# EAGLE schematic C7 (EAGLE 7.5.0)
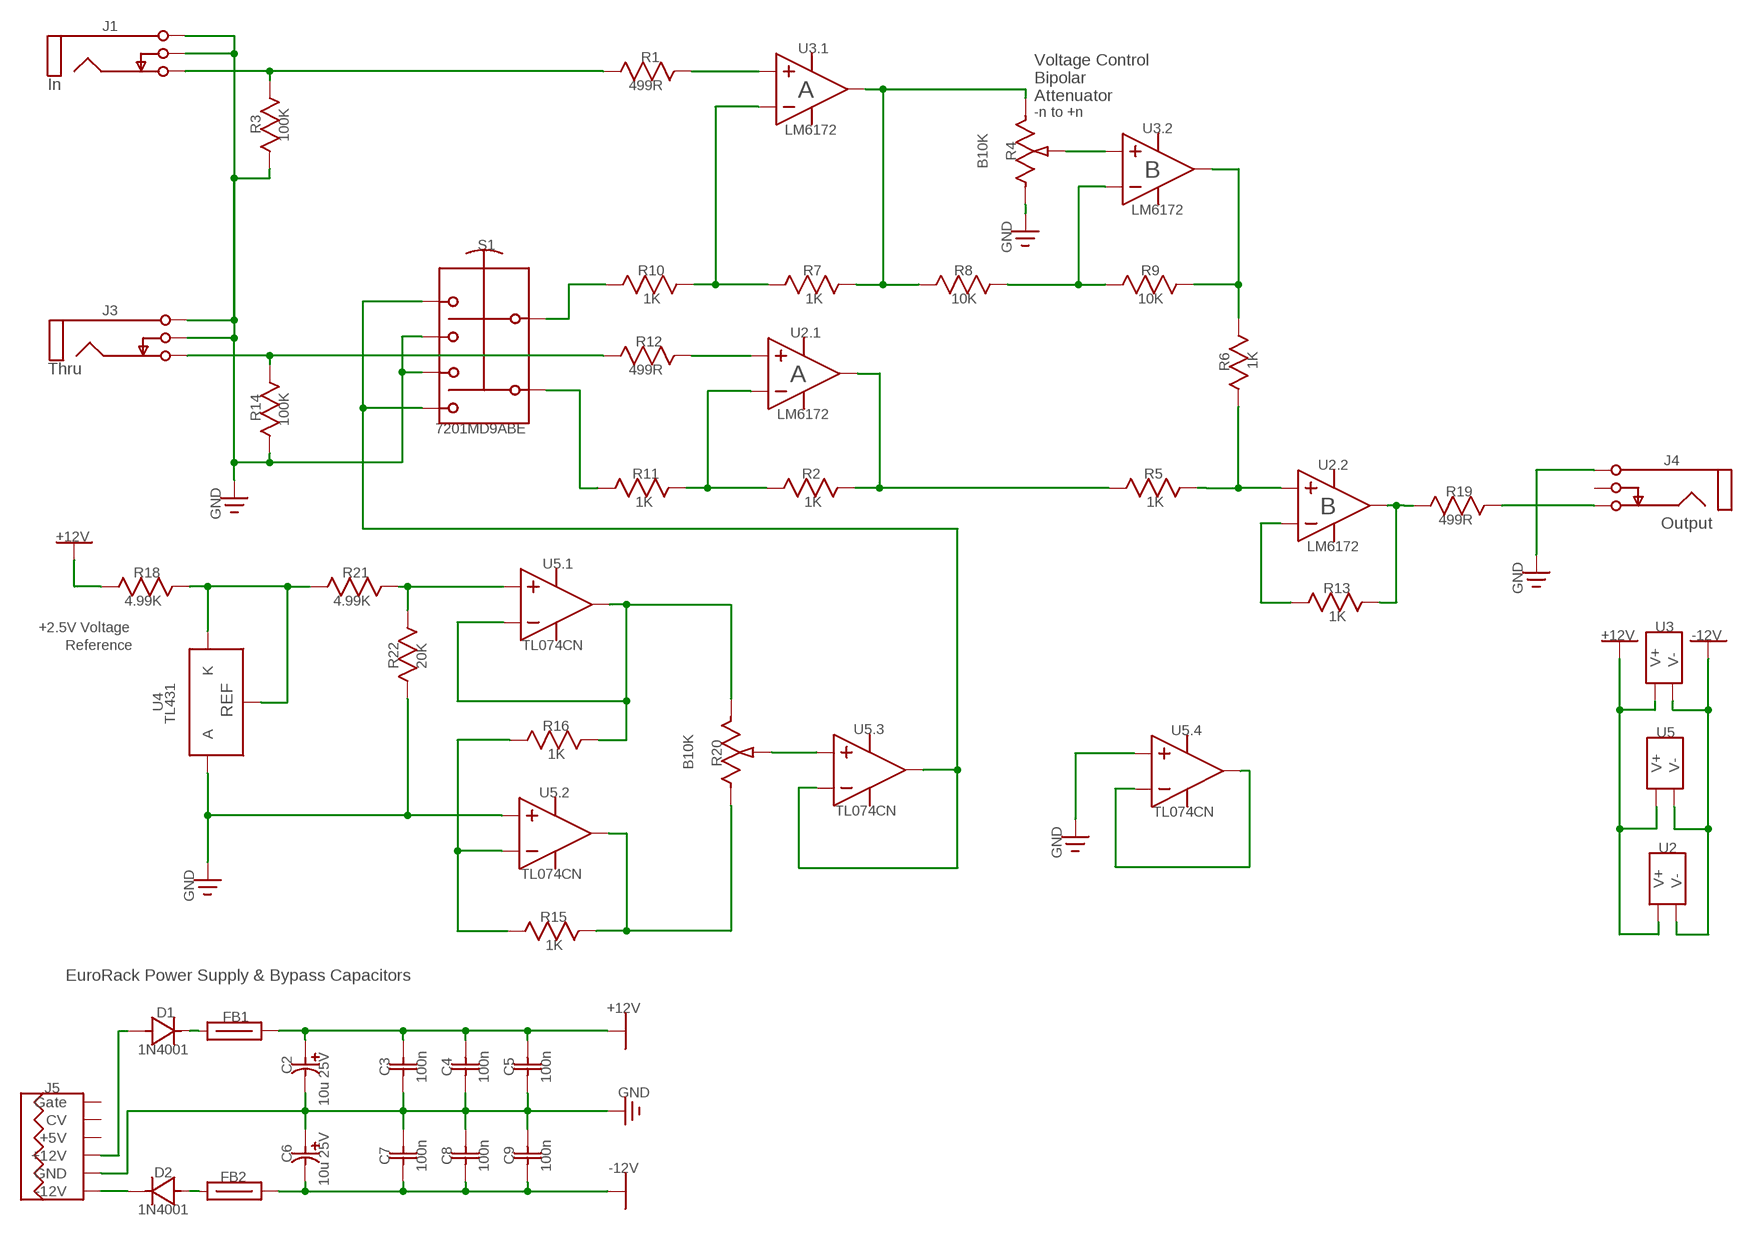
[diagram p0: schematic, sheet 1]

## Parts
C2  10u 25V  EC80-5  [CAPPR-2/5.08]
C3  100n  CAP100  [CAP-2.54/6.6X3]
C4  100n  CAP100  [CAP-2.54/6.6X3]
C5  100n  CAP100  [CAP-2.54/6.6X3]
C6  10u 25V  EC80-5  [CAPPR-2/5.08]
C7  100n  CAP100  [CAP-2.54/6.6X3]
C8  100n  CAP100  [CAP-2.54/6.6X3]
C9  100n  CAP100  [CAP-2.54/6.6X3]
D1  1N4001  [DO-41]
D2  1N4001  [DO-41]
FB1  68R  2743001111  [FB-10.16/4.45X3.5]
FB2  68R  2743001111  [FB-10.16/4.45X3.5]
J1  PJ302M  [PJ302M]
J3  PJ302M  [PJ302M]
J4  PJ302M_2  [PJ302M]
J5  EUROPWR16  [IDC16M]
R1  499R  RES300  [RES-7.62/5.1X2.5]
R2  1K  RES300  [RES-7.62/5.1X2.5]
R3  100K  RES300  [RES-7.62/5.1X2.5]
R4  B10K  ALPHA9H  [ALPHA9H]
R5  1K  RES300  [RES-7.62/5.1X2.5]
R6  1K  RES300  [RES-7.62/5.1X2.5]
R7  1K  RES300  [RES-7.62/5.1X2.5]
R8  10K  RES300  [RES-7.62/5.1X2.5]
R9  10K  RES300  [RES-7.62/5.1X2.5]
R10  1K  RES300  [RES-7.62/5.1X2.5]
R11  1K  RES300  [RES-7.62/5.1X2.5]
R12  499R  RES300  [RES-7.62/5.1X2.5]
R13  1K  RES300  [RES-7.62/5.1X2.5]
R14  100K  RES300  [RES-7.62/5.1X2.5]
R15  1K  RES300  [RES-7.62/5.1X2.5]
R16  1K  RES300  [RES-7.62/5.1X2.5]
R18  4.99K  RES300  [RES-7.62/5.1X2.5]
R19  499R  RES300  [RES-7.62/5.1X2.5]
R20  B10K  ALPHA9H_8  [ALPHA9H]
R21  4.99K  RES300  [RES-7.62/5.1X2.5]
R22  20K  RES300  [RES-7.62/5.1X2.5]
S1  7201MD9ABE  [7201-A]
U2  LM6172  [DIP-8]
U3  LM6172  [DIP-8]
U4  TL431  [TO-92-100R]
U5  TL074CN  [DIP-14]

## Nets
0V: C2.2(MINUS) C3.2 C4.2 C5.2 C6.1(PLUS) C7.1 C8.1 C9.1 J1.1A(Sleeve) J1.1B(Sleeve) J1.2A(Switch) J1.2B(Switch) J3.1A(Sleeve) J3.1B(Sleeve) J3.2A(Switch) J3.2B(Switch) J4.1A(Sleeve) J4.1B(Sleeve) J5.3(GND) J5.4(GND) J5.5(GND) R3.1(A) R4.1(CCW) R14.1(A) R22.2(B) S1.3 S1.3B S1.4 S1.4B U4.2(A) U5.5(PART_2:IN+) U5.12(PART_4:IN+) ; supply symbol labelled GND
+12V: C2.1(PLUS) C3.1 C4.1 C5.1 FB1.2 R18.2(B) U2.8(VCC_AND_GND:V+) U3.8(VCC_AND_GND:V+) U5.4(VCC_AND_GND:V+)
-12V: C6.2(MINUS) C7.2 C8.2 C9.2 FB2.2 U2.4(VCC_AND_GND:V-) U3.4(VCC_AND_GND:V-) U5.11(VCC_AND_GND:V-)
BUFFERED_VC_TO_FADER: R6.2(B) R9.2(B) U3.7(PART_2:OUT)
Net_0: R12.2(B) U2.3(PART_1:IN+)
Net_1: D2.2(A) FB2.1
Net_2: D1.1(K) FB1.1
Net_3: R2.1(A) R11.2(B) U2.2(PART_1:IN-)
Net_4: R16.2(B) R20.1(CCW) U5.1(PART_1:OUT) U5.2(PART_1:IN-)
Net_5: D2.1(K) J5.1(-12V) J5.2(-12V)
Net_6: R15.2(B) R20.3(CW) U5.7(PART_2:OUT)
Net_7: R20.2(W) U5.10(PART_3:IN+)
Net_8: S1.1 S1.1B S1.6 S1.6B U5.8(PART_3:OUT) U5.9(PART_3:IN-)
Net_10: R1.2(B) U3.3(PART_1:IN+)
Net_21: R13.2(B) R19.1(A) U2.7(PART_2:OUT)
Net_23: R4.2(W) U3.5(PART_2:IN+)
Net_24: R2.2(B) R5.1(A) U2.1(PART_1:OUT)
Net_25: R13.1(A) U2.6(PART_2:IN-)
Net_26: R5.2(B) R6.1(A) U2.5(PART_2:IN+)
Net_27: R15.1(A) R16.1(A) U5.6(PART_2:IN-)
Net_28: R10.1(A) S1.2(COMM) S1.2B(COMM)
Net_29: U5.13(PART_4:IN-) U5.14(PART_4:OUT)
Net_30: R21.1(A) R22.1(A) U5.3(PART_1:IN+)
Net_31: R11.1(A) S1.5(COMM) S1.5B(COMM)
Net_33: D1.2(A) J5.9(+12V) J5.10(+12V)
Net_34: J4.3A(Tip) J4.3B(Tip) R19.2(B)
Net_50: R18.1(A) R21.2(B) U4.1(K) U4.3(REF)
Net_52: R7.1(A) R10.2(B) U3.2(PART_1:IN-)
Net_53: R4.3(CW) R7.2(B) R8.1(A) U3.1(PART_1:OUT)
Net_54: R8.2(B) R9.1(A) U3.6(PART_2:IN-)
Net_58: J1.3A(Tip) J1.3B(Tip) R1.1(A) R3.2(B)
Net_64: J3.3A(Tip) J3.3B(Tip) R12.1(A) R14.2(B)
Unconnected: J4.2A(Switch) J4.2B(Switch) J5.11(+5V) J5.12(+5V) J5.13(CV) J5.14(CV) J5.15(Gate) J5.16(Gate)

## Notes on the sheet
- J1
- U3.1 | Voltage Control
- R1
- Bipolar
- In | 499R | A
- Attenuator
- -n to +n
- LM6172
- R3 | U3.2
- 100K
- R4 | B
- B10K
- LM6172
- S1 | GND
- R10 | R7 | R8 | R9
- 1K | 1K | 10K | 10K
- J3
- U2.1
- R12
- Thru | 499R | A
- R6 | 1K
- LM6172
- R14 | 7201MD9ABE
- 100K
- J4
- U2.2
- R11 | R2 | R5
- 1K | 1K | 1K | B | R19
- 499R | Output
- GND
- +12V | LM6172
- U5.1
- R18 | R21
- 4.99K | 4.99K | R13 | GND
- 1K
- +2.5V Voltage
- U3
- Reference | TL074CN | +12V | -12V
- R22 | 20K
- U4
- REF
- TL431
- R16 | U5.3
- U5.4 | U5
- 1K
- B10K | R20
- U5.2
- TL074CN | TL074CN
- U2
- GND
- TL074CN
- GND
- R15
- 1K
- EuroRack Power Supply & Bypass Capacitors
- +12V
- D1
- FB1
- 1N4001
- C2 | C3 | C4 | C5
- 100n | 100n | 100n
- J5
- GND
- 10u 25V
- C6 | C7 | C8 | C9
- 100n | 100n | 100n | -12V
- D2
- FB2 | 10u 25V
- 1N4001

## Library data of the parts
C2 C6 = common:EC80-5
C3-C5 C7-C9 = common:CAP100
D1 D2 = common:1N4001
FB1 FB2 = common:2743001111; MANUFACTURER: Fair-Rite
J1 J3 = common:PJ302M; DATASHEET: http://www.thonk.co.uk/shop/pj302m/
J4 = common:PJ302M_2; DATASHEET: http://www.thonk.co.uk/shop/pj302m/
J5 = common:EUROPWR16
R1 R12 R19 = common:RES300
R2 R3 R5-R11 R13-R16 R18 R21 R22 = common:RES300; VALUE: 499R
R4 = common:ALPHA9H; DATASHEET: http://www.thonk.co.uk/shop/alpha-9mm-pots/; MANUFACTURER: Alpha
R20 = common:ALPHA9H_8; DATASHEET: http://www.thonk.co.uk/shop/alpha-9mm-pots/; MANUFACTURER: Alpha
S1 = common:7201MD9ABE; DATASHEET: http://datasheets.diptrace.com/switches/7000_series.pdf; MANUFACTURER: C&K
U2 U3 = common:LM6172; DATASHEET: http://www.ti.com/lit/gpn/lm6172; MANUFACTURER: Texas Instruments
U4 = common:TL431; DATASHEET: http://datasheets.diptrace.com\st_micro\CD00000986.pdf; MANUFACTURER: ST Microelectronics
U5 = common:TL074CN; MANUFACTURER: Motorola